# EasyEDA Pro project ProProject_Access Control AC Power Switch_2024-06-06.epro, board V2.0.1B PCB
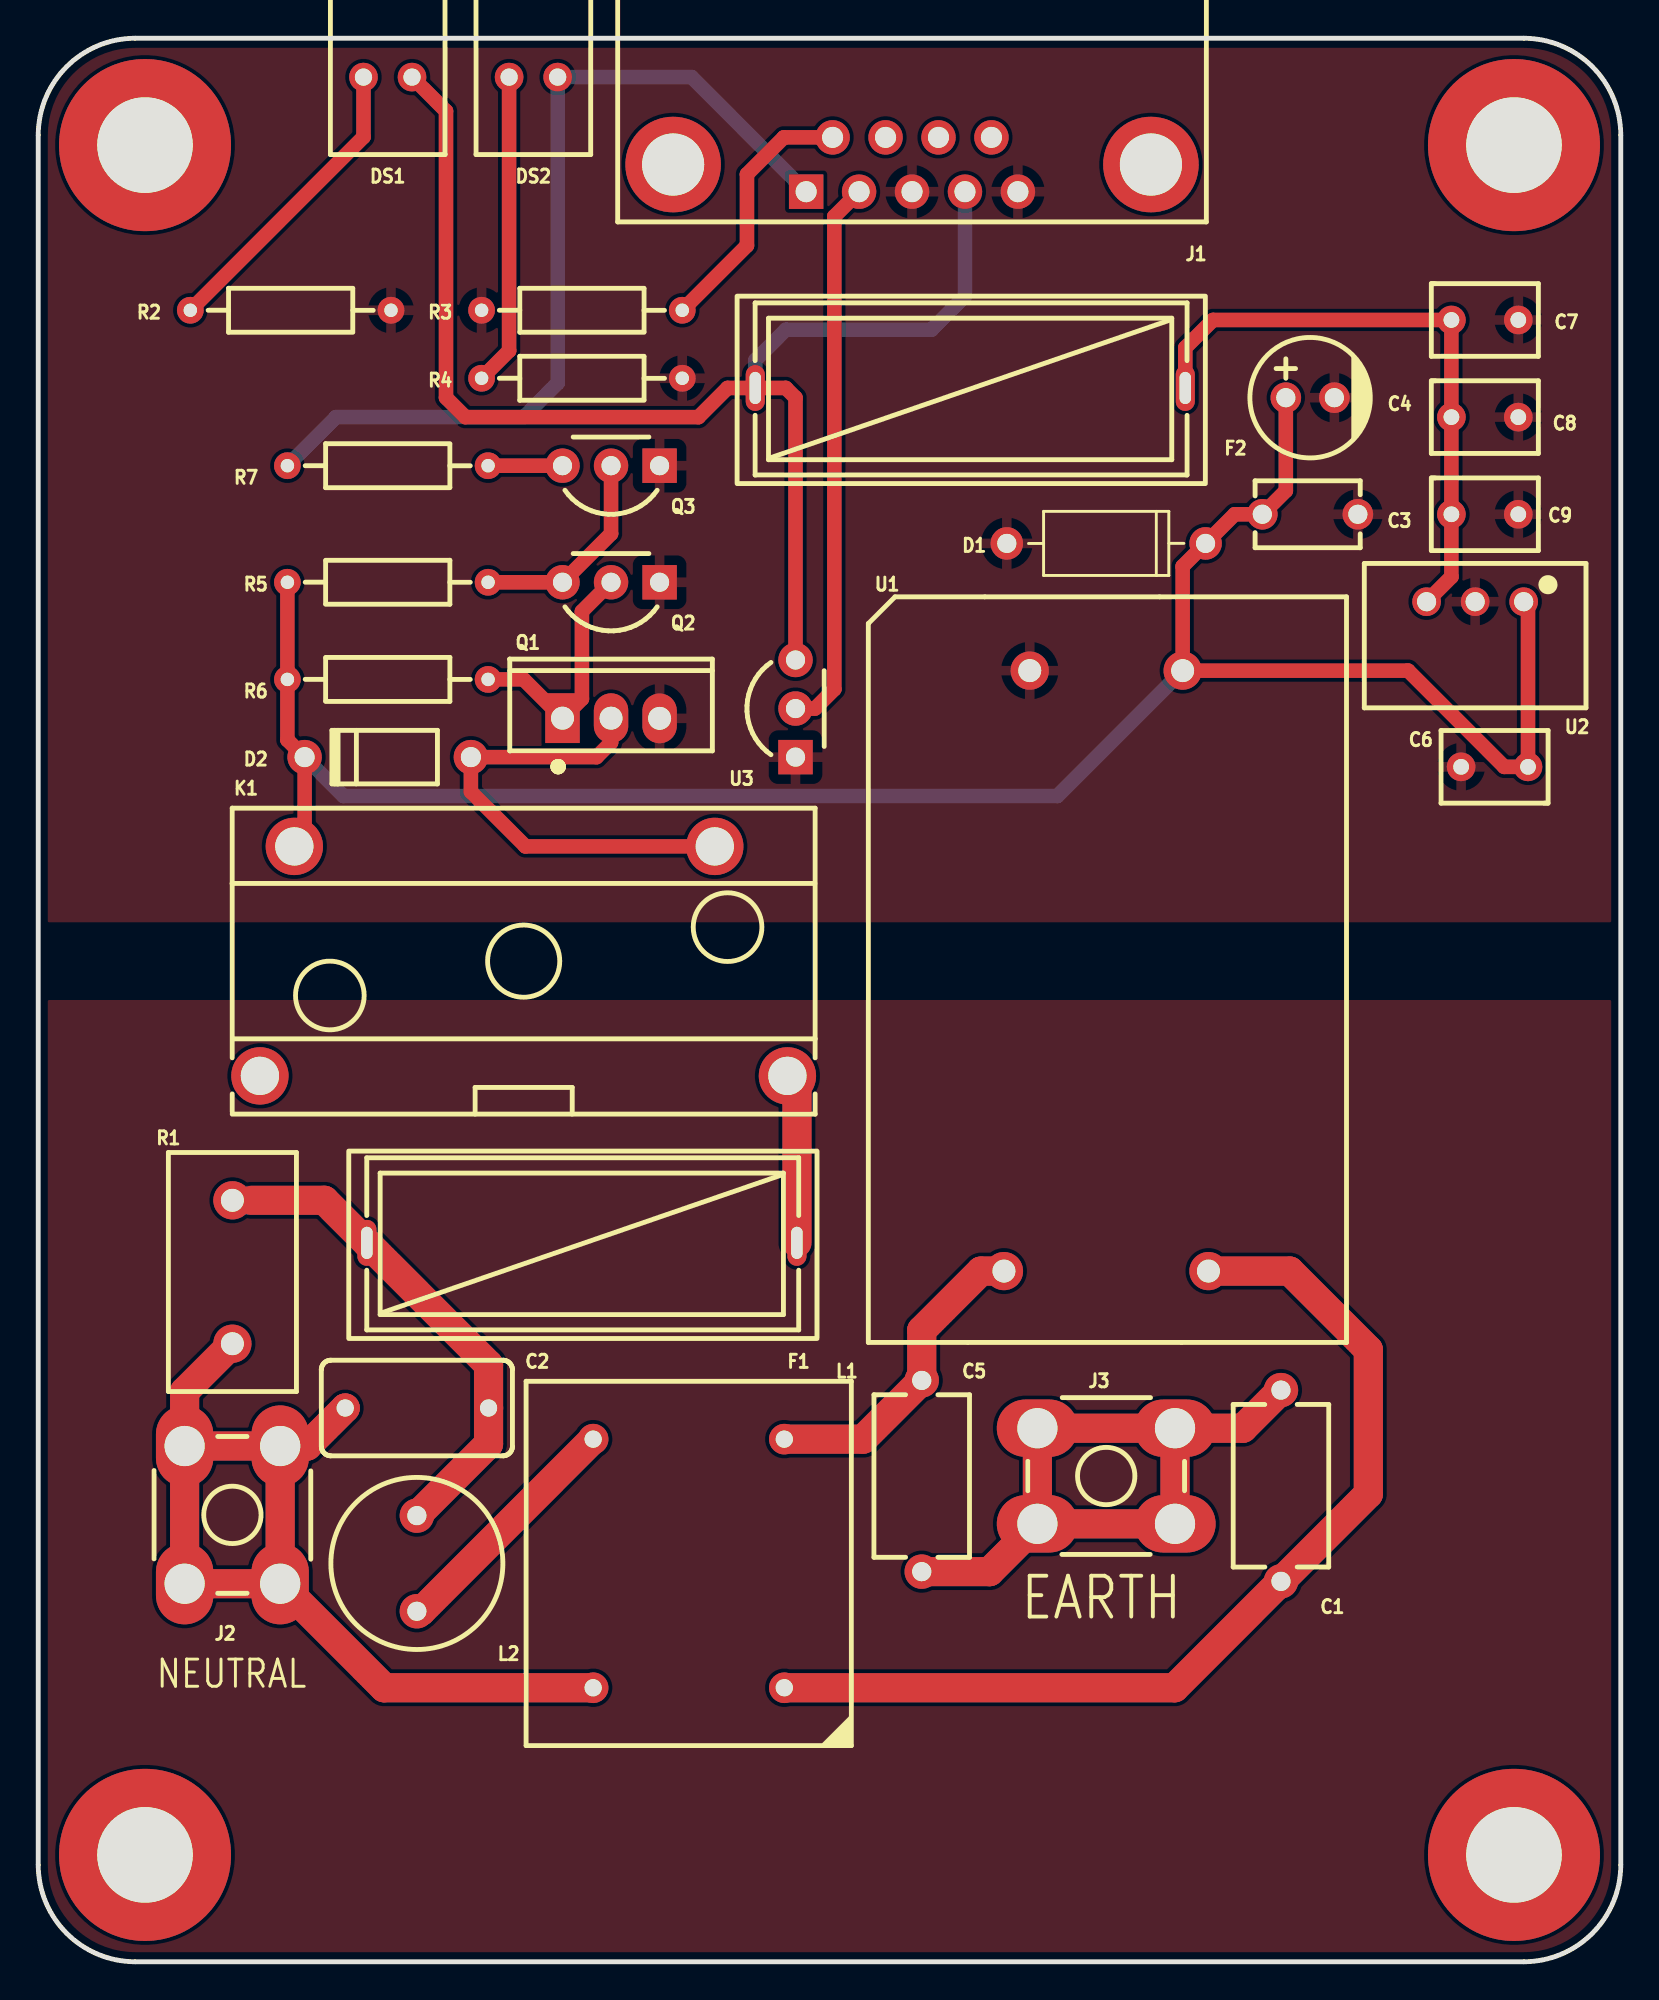
[diagram p3: board, top side]
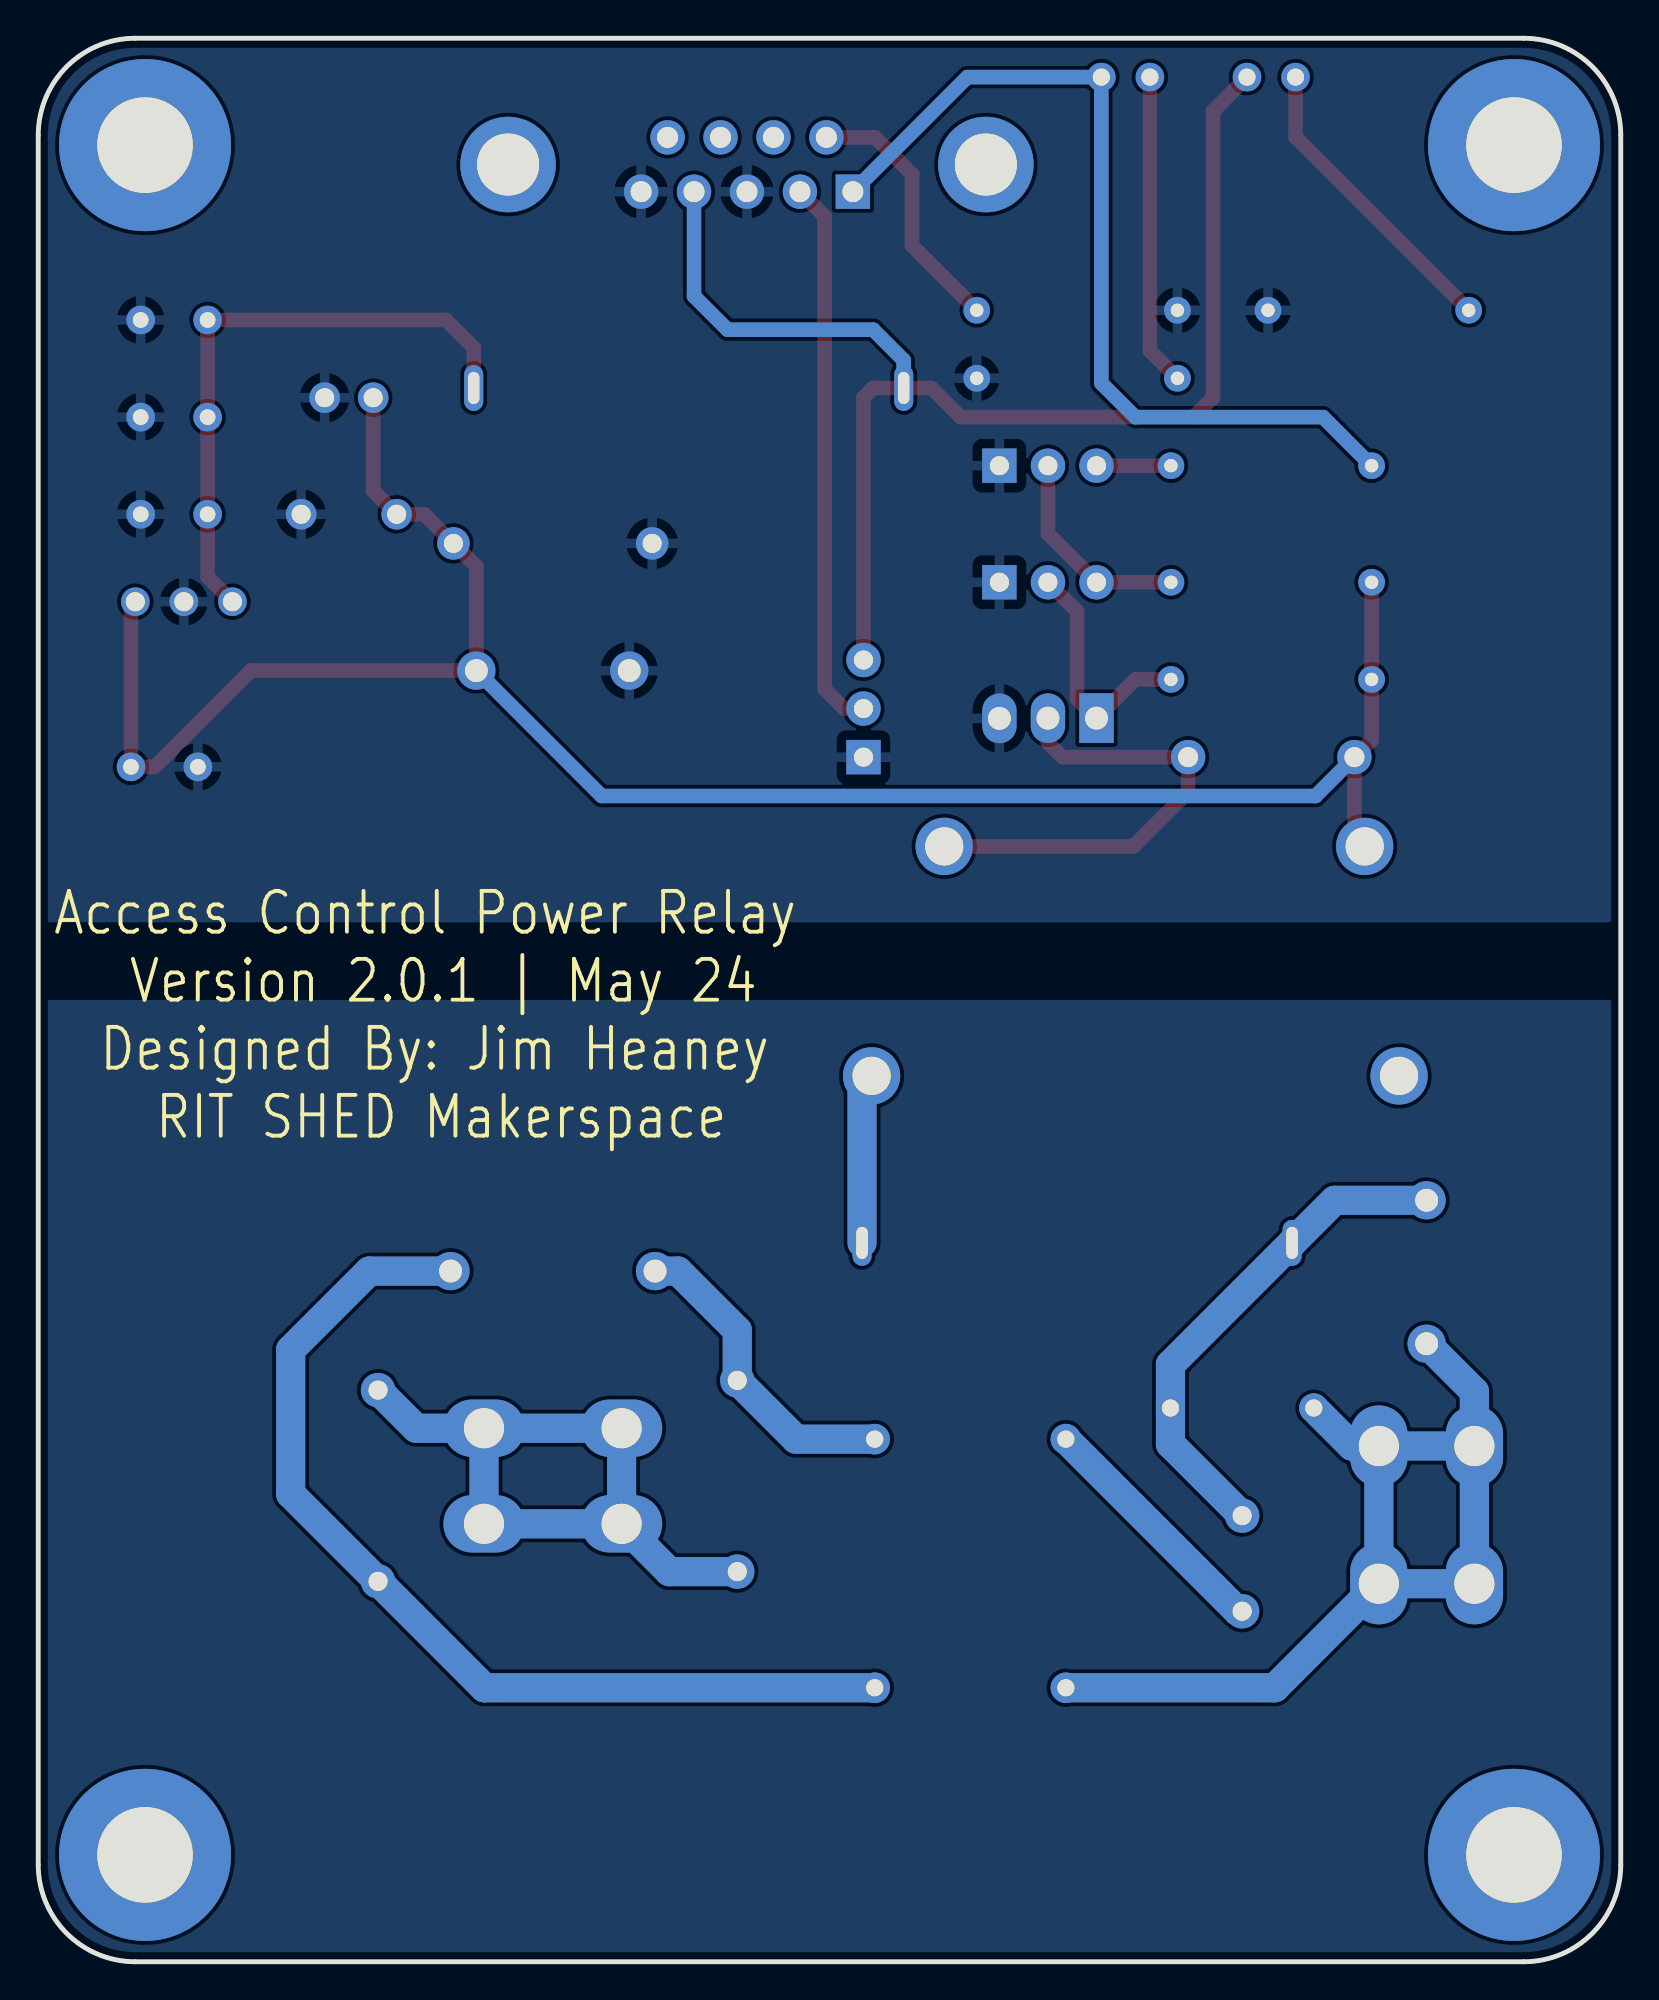
[diagram p4: board, bottom side, seen from below]

Outline 82.8 x 100.58 mm; copper layers: Top Layer, Bottom Layer. Coordinates in mm from the lower left corner of the outline.
Outline path: 0,95.5 0,5.08 arc(1.49,1.49) 5.08,0 77.72,0 arc(81.32,1.49) 82.8,5.08 82.8,95.5 arc(81.32,99.1) 77.72,100.58 5.08,100.58 arc(1.49,99.1) 0,95.5
Stack: Top Layer 0.035mm / Dielectric1 1.51mm FR4 er 4.5 / Bottom Layer 0.035mm

## Design rules (mm)
template: Custom Config
spacing copperThickness1oz (default): track to track 0.102, other pairs 0.152 to 0.3
spacing copperThickness2oz: track to track 0.203, other pairs 0.152 to 0.3
track width copperThickness1oz (default): min 0.127, default 0.254, max 2.54
track width copperThickness2oz: min 0.203, default 0.254, max 2.54
differential pair differentialPair (default): width min 0.127, default 0.254, max 2.54; gap min 0.152, default 0.152
via viaSize (default): diameter min 0.5, default 0.61, max 10; hole min 0.3, default 0.305, max 6.3
net STEAL uses stealcopper
pour e538 uses stealcopper

## Placement (name value [footprint] x y rotation side)
C1  1nF  [CAP-TH_L8.5-W5.0-P10.00-D0.6]  65.02 24.89 270 top
C2  100nF  [CAP-TH_L10.0-W5.0-P7.50-D0.6]  19.81 28.96 180 top
C3  1uF  [CAP-TH_L5.5-W3.5-P5.00-D1.2]  66.55 75.69 180 top
C4  220uF  [CAP-TH_BD6.3-P2.50-D1.0-FD]  66.55 81.79 0 top
C5  1nF  [CAP-TH_L8.5-W5.0-P10.00-D0.6]  46.23 25.4 270 top
C6  10uF  [CAP-TH_L5.5-W3.8-P3.50-D0.6]  76.2 62.48 180 top
C7  10uF  [CAP-TH_L5.5-W3.8-P3.50-D0.6]  75.69 85.85 0 top
C8  10uF  [CAP-TH_L5.5-W3.8-P3.50-D0.6]  75.69 80.77 0 top
C9  10uF  [CAP-TH_L5.5-W3.8-P3.50-D0.6]  75.69 75.69 0 top
D1  P6KE15A  [DO-15_BD3.2-L6.4-P10.40-D0.8-RD]  55.88 74.17 180 top
D2  1N4007  [DO-41_BD2.4-L4.7-P8.70-D0.8-RD]  18.29 62.99 0 top
DS1  MHK1560CRBTD  [LED-TH_MHK1560UGBTD]  18.29 98.55 180 top
DS2  MHK1560UGBTD  [LED-TH_MHK1560UGBTD]  25.91 98.55 180 top
F1  Fuse Holder  [FUSE-TH_L24.5-W9.8-P22.5]  28.45 37.59 180 top
F2  Fuse Holder  [FUSE-TH_L24.5-W9.8-P22.5]  48.77 82.3 180 top
J1  D-SUB-DR-9PCM-CB  [DB9-TH_ID09S33E4GV00LF]  45.72 93.98 180 top
J2  T34001  [CONN-TH_T34001]  10.16 23.37 0 top
J3  T34001  [CONN-TH_T34001]  55.88 25.4 90 top
K1  HF102F-12VDC  [RELAY-TH_HF102F-12VDC]  25.4 52.32 0 top
L1  YDUU10.5-253L0321  [IND-TH_4P-L19.0-W17.0]  34.04 20.83 90 top
L2  560uH  [IND-TH_BD9.0-P5.00-D0.7]  19.81 20.83 270 top
NOREF  -  [Pad_e184]  77.22 5.59 0 top
NOREF#2  -  [Pad_e181]  5.59 5.59 0 top
NOREF#3  -  [Pad_e183]  77.22 95 0 top
NOREF#4  -  [Pad_e182]  5.59 95 0 top
Q1  BRCS3205RA  [TO-220-3_L10.0-W4.5-P2.54-L]  29.97 65.02 0 top
Q2  2SC1815L-GR-T92-B  [TO-92-3_L4.9-W3.7-P2.54-L]  29.97 72.14 180 top
Q3  2SC1815L-GR-T92-B  [TO-92-3_L4.9-W3.7-P2.54-L]  29.97 78.23 180 top
R1  10D471K  [RES-TH_L12.5-W6.7-P7.50-D1.2]  10.16 36.07 270 top
R2  1kΩ  [RES-TH_BD2.3-L6.5-P10.50-D0.5]  13.21 86.36 0 top
R3  5.1kΩ  [RES-TH_BD2.3-L6.5-P10.50-D0.5]  28.45 86.36 0 top
R4  1kΩ  [RES-TH_BD2.3-L6.5-P10.50-D0.5]  28.45 82.8 0 top
R5  5.1kΩ  [RES-TH_BD2.3-L6.5-P10.50-D0.5]  18.29 72.14 180 top
R6  5.1kΩ  [RES-TH_BD2.3-L6.5-P10.50-D0.5]  18.29 67.06 180 top
R7  5.1kΩ  [RES-TH_BD2.3-L6.5-P10.50-D0.5]  18.29 78.23 0 top
U1  TAS10-12-W2  [PWRM-TH_TAS10-XX-W2]  55.88 51.82 90 top
U2  K7805-1000R3  [PWRM-TH_YLPTEC_K78XX-1000R3]  75.18 71.12 180 top
U3  DS18B20+T&R  [TO-92-3_L4.9-W3.7-P2.54-L]  39.62 65.53 90 top

## Footprints (pads in the part's own frame, mm; a bottom-side part is the same pattern mirrored in y, then rotated)
CAP-TH_BD6.3-P2.50-D1.0-FD
  round 1.6 hole 1: 1(-1.27,0) 2(1.27,0)
CAP-TH_L5.5-W3.5-P5.00-D1.2
  round 1.6 hole 1: 1(-2.5,0) 2(2.5,0)
CAP-TH_L5.5-W3.8-P3.50-D0.6
  round 1.5 hole 0.82: 1(-1.75,0) 2(1.75,0)
CAP-TH_L8.5-W5.0-P10.00-D0.6
  round 1.8 hole 1: 1(-5,0) 2(5,0)
CAP-TH_L10.0-W5.0-P7.50-D0.6
  round 1.524 hole 0.9: 1(-3.75,0) 2(3.75,0)
CONN-TH_T34001
  oval 3x4.25 hole 2.1: 1(-2.5,-3.6) 2(2.5,-3.6) 3(2.5,3.6) 4(-2.5,3.6)
DB9-TH_ID09S33E4GV00LF
  rect 1.8x1.8 hole 1.1: 1(5.54,1.42)
  round 1.8 hole 1.1: 2(2.77,1.42) 3(0,1.42) 4(-2.77,1.42) 5(-5.54,1.42) 6(4.155,-1.42) 7(1.385,-1.42) 8(-1.385,-1.42) 9(-4.155,-1.42)
  round 5 hole 3.25: 10(-12.5,0) 11(12.5,0)
DO-15_BD3.2-L6.4-P10.40-D0.8-RD
  round 1.7 hole 1: 1(-5.2,0) 2(5.2,0)
DO-41_BD2.4-L4.7-P8.70-D0.8-RD
  round 1.8 hole 1.05: 1(-4.35,0) 2(4.35,0)
FUSE-TH_L24.5-W9.8-P22.5
  oval 1x2.4 hole 0.6x1.68: 1(-11.25,0) 2(11.25,0)
IND-TH_4P-L19.0-W17.0
  round 1.6 hole 0.9: 1(-6.5,-5) 2(6.5,-5) 3(-6.5,5) 4(6.5,5)
IND-TH_BD9.0-P5.00-D0.7
  round 1.8 hole 1: 1(-2.5,0) 2(2.5,0)
LED-TH_MHK1560UGBTD
  round 1.5 hole 0.9: 1(1.27,0) 2(-1.27,0)
Pad_e181
  round 9 hole 5: 5(0,0)
Pad_e182
  round 9 hole 5: 5(0,0)
Pad_e183
  round 9 hole 5: 5(0,0)
Pad_e184
  round 9 hole 5: 5(0,0)
PWRM-TH_TAS10-XX-W2
  round 2 hole 1.2: 1(-15.7,-5.35) 2(-15.7,5.35) 4(15.7,4) 6(15.7,-4)
PWRM-TH_YLPTEC_K78XX-1000R3
  round 1.5 hole 1: 1(-2.54,0) 2(0,0) 3(2.54,0)
RELAY-TH_HF102F-12VDC
  round 3 hole 2: 1(-12,6) 2(10,6) 3(13.8,-6) 4(-13.8,-6)
RES-TH_BD2.3-L6.5-P10.50-D0.5
  round 1.4 hole 0.7: 1(-5.25,0) 2(5.25,0)
RES-TH_L12.5-W6.7-P7.50-D1.2
  round 2 hole 1.2: 1(-3.749,0) 2(3.749,0)
TO-92-3_L4.9-W3.7-P2.54-L
  rect 1.8x1.8 hole 1: 1(-2.54,0)
  round 1.8 hole 1: 2(0,0) 3(2.54,0)
TO-220-3_L10.0-W4.5-P2.54-L
  rect 1.8x2.6 hole 1.2: 1(-2.54,0.005)
  oval 1.8x2.6 hole 1.2: 2(0,0.005) 3(2.54,-0.005)

## Nets
As in the schematic.

Pads without a net: J1 7 8 9 10 11; K1 4; NOREF 5; NOREF#2 5; NOREF#3 5; NOREF#4 5

## Routing (per net, layer and track width the routed paths; a pad name or vN(x,y) marks a point on that pad's centre or on a via; arc(x,y) is an arc through that point)
EARTH: length 75.7
  Top Layer w1.524: J3.2 J3.3 J3.4 ; J3.2 J3.1 J3.4 ; J3.2 63.03,27.9 C1.1 ; J3.4 49.78,20.4 C5.2
  Bottom Layer w1.524: J3.2 J3.1 J3.4 ; J3.2 J3.3 J3.4 ; J3.2 63.03,27.9 C1.1 ; C5.2 49.78,20.4 J3.4
LIVE_IN: length 17.9
  Top Layer w1.524: F1.1 39.7,45.83 K1.3
  Bottom Layer w1.524: K1.3 39.7,45.83 F1.1
NEUTRAL: length 107.3
  Top Layer w1.524: J2.4 J2.3 ; J2.4 J2.1 J2.2 ; J2.4 7.66,29.82 R1.2 ; J2.3 14.07,26.97 C2.2 ; J2.3 J2.2 ; J2.2 18.1,14.33 L1.3
  Bottom Layer w1.524: J2.2 J2.1 J2.4 ; J2.2 18.1,14.33 L1.3 ; J2.2 J2.3 ; J2.3 J2.4 ; J2.3 14.07,26.97 C2.2 ; R1.2 7.66,29.82 J2.4
NO_SIG: length 47.4
  Bottom Layer w0.762: J1.1 34.19,98.55 DS2.2 27.18,82.55 25.4,80.77 15.58,80.77 R7.1
TEMP: length 29
  Top Layer w0.762: J1.2 41.66,91.27 41.66,66.55 40.64,65.53 U3.2
VRAW: length 110.1
  Top Layer w0.762: R5.2 R6.2 13.04,63.89 D2.1 13.94,58.86 K1.1 ; U2.1 77.95,70.89 C6.1 76.71,62.48 71.68,67.52 U1.6 59.88,72.97 D1.1 62.6,75.69 C3.2 65.28,76.92 C4.1
  Bottom Layer w0.762: D2.1 15.97,60.96 53.32,60.96 U1.6
VSW: length 70
  Top Layer w0.762: U3.3 39.62,81.79 39.12,82.3 F2.2 36.07,82.3 34.54,80.77 22.35,80.77 21.34,81.79 21.34,96.77 DS1.2
  Bottom Layer w0.762: J1.4 48.49,87.1 46.74,85.34 39.12,85.34 37.52,83.75 F2.2
$1N597: length 51.8
  Top Layer w1.524: 11.18,39.82 14.97,39.82 F1.2 23.56,31.23 C2.1 23.56,27.08 L2.1
  Bottom Layer w1.524: R1.1 14.97,39.82 F1.2 23.56,31.23 C2.1 23.56,27.08 L2.1
$1N1225: length 31.9
  Top Layer w0.762: U2.3 73.94,72.42 C9.1 C8.1 C7.1 61.47,85.85 60.02,84.4 F2.1
$1N1636: length 24.7
  Top Layer w0.762: K1.2 25.5,58.32 22.64,61.18 D2.2 29.21,62.99 29.97,63.75 29.97,65.02
$1N1642: length 11
  Top Layer w0.762: Q3.2 29.97,74.68 Q2.3 R5.1
$1N1643: length 3.9
  Top Layer w0.762: Q3.3 R7.2
$1N1954: length 25.9
  Top Layer w1.524: L1.4 20.04,18.33 L2.2
  Bottom Layer w1.524: L1.4 20.04,18.33 L2.2
$1N1959: length 33.3
  Top Layer w1.524: L1.2 43.16,27.33 C5.1 46.23,33.02 49.32,36.12 U1.2
  Bottom Layer w1.524: L1.2 43.16,27.33 C5.1 46.23,33.02 49.32,36.12 U1.2
$1N1966: length 104.7
  Top Layer w1.524: L1.1 59.46,14.33 C1.2 69.6,24.46 69.6,32 65.48,36.12 U1.1
  Bottom Layer w1.524: U1.1 65.48,36.12 69.6,32 69.6,24.46 C1.2 59.46,14.33 L1.1
$1N3133: length 15.9
  Top Layer w0.762: R2.1 17.02,95.42 DS1.1
$1N3135: length 16.3
  Top Layer w0.762: R4.1 24.64,84.24 DS2.1
$1N3143: length 13.8
  Top Layer w0.762: R3.2 37.08,89.75 37.08,93.47 39.01,95.4 J1.6
$1N3234: length 12.9
  Top Layer w0.762: Q2.2 28.45,70.61 28.45,66.04 27.43,65.02 25.4,67.06 R6.1

## Copper pours and planes (outline as drawn; the poured copper is in the pictures)
GND on Top Layer: -14.22,103.12 88.39,103.12 88.39,54.36 -14.22,54.36
GND on Bottom Layer: -3.05,107.19 93.47,107.19 93.47,54.36 -3.05,54.36
STEAL on Top Layer: -3.05,50.29 103.63,50.29 103.63,0 -3.05,0
STEAL on Bottom Layer: -3.05,50.29 93.47,50.29 93.47,-3.05 -3.05,-3.05

## Text on the board
Bottom Silkscreen Layer: RIT SHED Makerspace | Version 2.0.1 | May 24 | Designed By: Jim Heaney | Access Control Power Relay
Top Silkscreen Layer: NEUTRAL | EARTH
